# Altium project B202AA-PCIe.PrjPcb
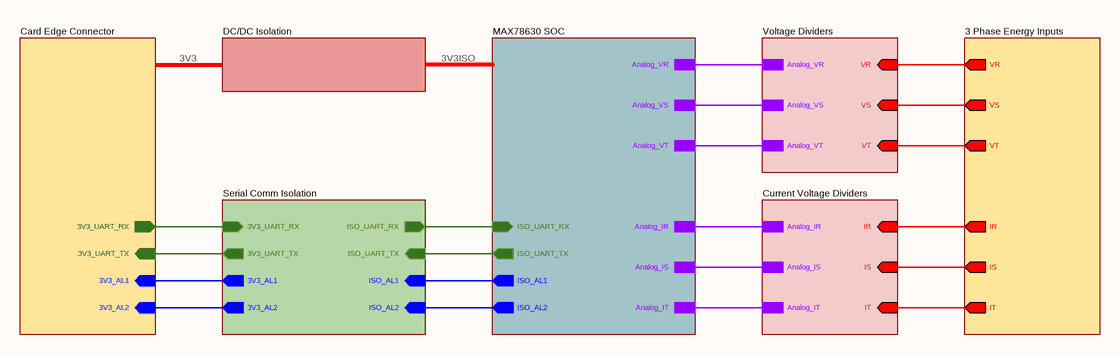
[diagram p0: Block Diagram.SchDoc]
Address1_: Buyuk Kayacik Mah. 4. OSB; Address2_: 103. Cad. No : 12; Address3_: Selcuklu / Konya; Address4_: Türkiye; Copyright_: Copyright 2022 STF Tarim (Commercial Secret); Customer_: -; Engineer_: Gunce Akkoyun; Git_Repo_Address_: www.github.com/akkoyun/B202AA-PCIe; Module_ID_: B202AA-PCIe; Organization_: -; Product_Desc_: PollyPhase Energy Analyzer; Product_ID_: B202AA-PCIe; Revision_: 00.00.01; Version_: R1
7 sheets, 64 parts. Net scope: hierarchical (ports join the sheet entries above them; power ports are global).
Board file: B202AA-PCIe.PcbDoc
Sheets:
  Block Diagram.SchDoc
    MAX78630 SOC = MAX78630 SOC.SchDoc
    Voltage Dividers = Phase Voltage Dividers.SchDoc
    Current Voltage Dividers = Current Voltage Dividers.SchDoc
    Serial Comm Isolation = Signal Isolation.SchDoc
    DC/DC Isolation = Power Isolation.SchDoc
    Card Edge Connector = Card Edge Connecgtor.SchDoc

## Sheet Block Diagram.SchDoc: B202AA Block Diagram
size 292 x 193 mm; SheetNumber: 1; SheetTotal: 8

### Sub-sheets
3 Phase Energy Inputs = Energy Inputs.SchDoc (file not in this document): VS (out), VR (out), IS (out), IT (out), VT (out), IR (out)
Card Edge Connector = Card Edge Connecgtor.SchDoc: 3V3_UART_RX (out), 3V3_UART_TX (in), 3V3_AL1 (in), 3V3_AL2 (in)
Current Voltage Dividers = Current Voltage Dividers.SchDoc: Analog_IS, Analog_IT, Analog_IR, IT (in), IS (in), IR (in)
DC/DC Isolation = Power Isolation.SchDoc: no entries
MAX78630 SOC = MAX78630 SOC.SchDoc: Analog_VR, Analog_VS, Analog_VT, Analog_IS, Analog_IT, Analog_IR, ISO_UART_RX (in), ISO_UART_TX (out), ISO_AL1 (out), ISO_AL2 (out)
Serial Comm Isolation = Signal Isolation.SchDoc: 3V3_UART_TX (out), 3V3_UART_RX (in), ISO_UART_RX (out), ISO_UART_TX (in), ISO_AL2 (in), 3V3_AL2 (out), 3V3_AL1 (out), ISO_AL1 (in)
Voltage Dividers = Phase Voltage Dividers.SchDoc: Analog_VR, Analog_VS, Analog_VT, VR (in), VT (in), VS (in)

### Nets
3V3_AL1: sheet Serial Comm Isolation/3V3_AL1, sheet Card Edge Connector/3V3_AL1
3V3_AL2: sheet Serial Comm Isolation/3V3_AL2, sheet Card Edge Connector/3V3_AL2
3V3_UART_RX: sheet Serial Comm Isolation/3V3_UART_RX, sheet Card Edge Connector/3V3_UART_RX
3V3_UART_TX: sheet Serial Comm Isolation/3V3_UART_TX, sheet Card Edge Connector/3V3_UART_TX
Analog_IR: sheet MAX78630 SOC/Analog_IR, sheet Current Voltage Dividers/Analog_IR
Analog_IS: sheet MAX78630 SOC/Analog_IS, sheet Current Voltage Dividers/Analog_IS
Analog_IT: sheet MAX78630 SOC/Analog_IT, sheet Current Voltage Dividers/Analog_IT
Analog_VR: sheet MAX78630 SOC/Analog_VR, sheet Voltage Dividers/Analog_VR
Analog_VS: sheet MAX78630 SOC/Analog_VS, sheet Voltage Dividers/Analog_VS
Analog_VT: sheet MAX78630 SOC/Analog_VT, sheet Voltage Dividers/Analog_VT
IR: sheet Current Voltage Dividers/IR, sheet 3 Phase Energy Inputs/IR
IS: sheet Current Voltage Dividers/IS, sheet 3 Phase Energy Inputs/IS
ISO_AL1: sheet MAX78630 SOC/ISO_AL1, sheet Serial Comm Isolation/ISO_AL1
ISO_AL2: sheet MAX78630 SOC/ISO_AL2, sheet Serial Comm Isolation/ISO_AL2
ISO_UART_RX: sheet MAX78630 SOC/ISO_UART_RX, sheet Serial Comm Isolation/ISO_UART_RX
ISO_UART_TX: sheet MAX78630 SOC/ISO_UART_TX, sheet Serial Comm Isolation/ISO_UART_TX
IT: sheet Current Voltage Dividers/IT, sheet 3 Phase Energy Inputs/IT
VR: sheet Voltage Dividers/VR, sheet 3 Phase Energy Inputs/VR
VS: sheet Voltage Dividers/VS, sheet 3 Phase Energy Inputs/VS
VT: sheet Voltage Dividers/VT, sheet 3 Phase Energy Inputs/VT

### Notes on the sheet
- 3V3
- 3V3ISO
- © 2021 All rights reserved.
  This document may not, in whole or in part, be copied, photocopied, reproduced, translated or converted to any electronic or machine readable from without prior written permission of Mehmet Günce Akkoyun.
  Engineer contact : akkoyun@me.com
- Property of
- Engineer :
- Date :
- Size :
- A4
- Time :
- Project :
- Page :
- /
- Customer :
- Product ID :
- Module ID :
- Version :
- File :
- Revision :

## Sheet MAX78630 SOC.SchDoc: MAX78630 SOC Core
size 393 x 292 mm; SheetNumber: 8; SheetTotal: 8
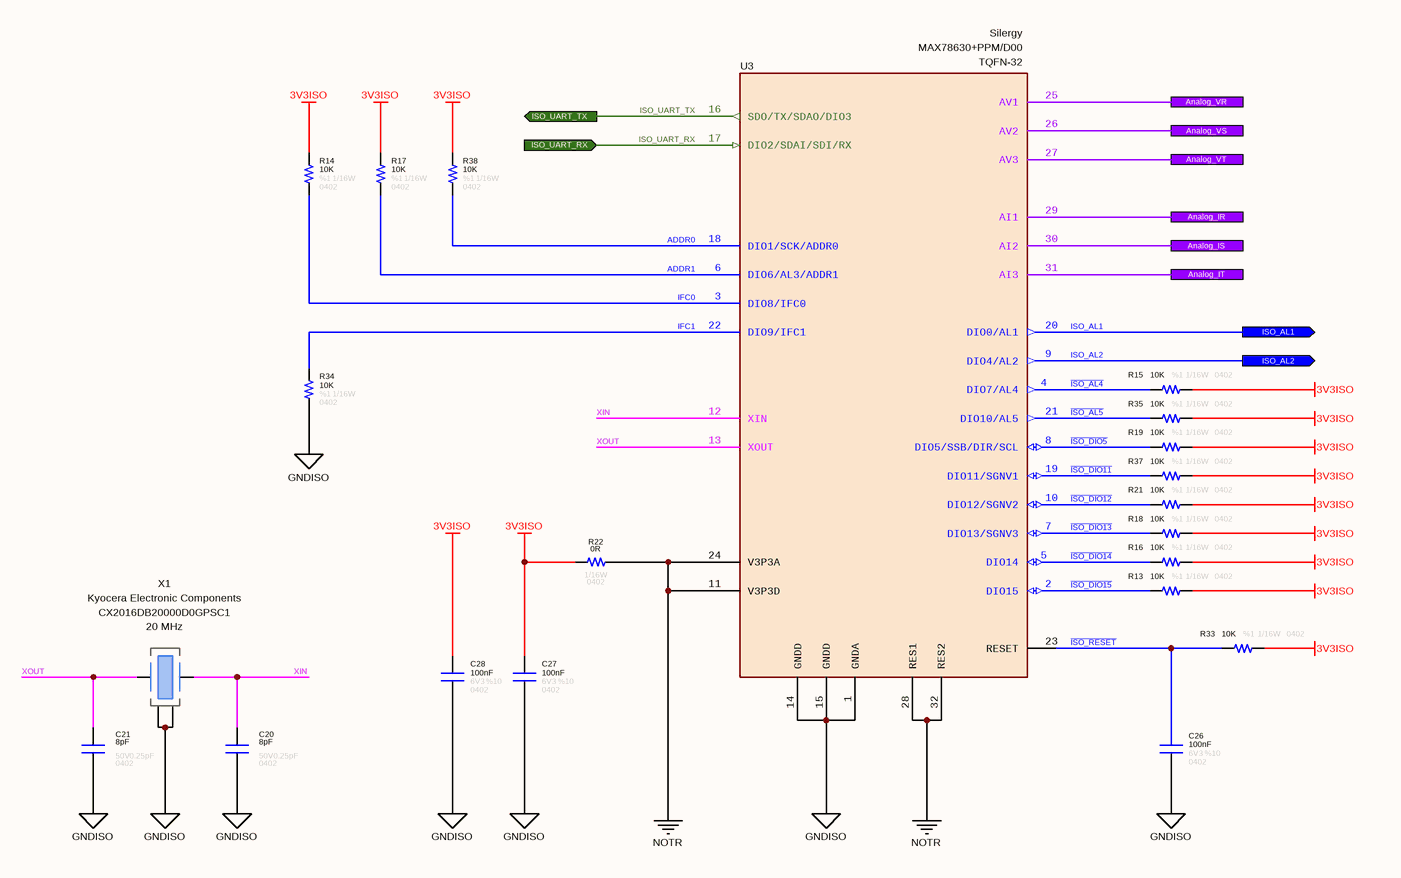
[diagram p1: MAX78630 SOC.SchDoc]

### Parts
C20  value 8pF  Tolerance: 0.25pF  Case: 0402  Voltage: 50V  [CAPACITOR_0402]  (hidden comment: Capacitor - 8pF [0402] (Ceramic))
C21  value 8pF  Tolerance: 0.25pF  Case: 0402  Voltage: 50V  [CAPACITOR_0402]  (hidden comment: Capacitor - 8pF [0402] (Ceramic))
C26  value 100nF  Tolerance: %10  Voltage: 6V3  Case: 0402  [CAPACITOR_0402]  (hidden comment: Capacitor - 100nF [0402] (Ceramic))
C27  value 100nF  Tolerance: %10  Voltage: 6V3  Case: 0402  [CAPACITOR_0402]  (hidden comment: Capacitor - 100nF [0402] (Ceramic))
C28  value 100nF  Tolerance: %10  Voltage: 6V3  Case: 0402  [CAPACITOR_0402]  (hidden comment: Capacitor - 100nF [0402] (Ceramic))
R13  value 10K  Tolerance: %1  Case: 0402  Power: 1/16W  [RESISTOR_0402]  (hidden comment: 10K - 0402 - %1 - 1/16W)
R14  value 10K  Tolerance: %1  Case: 0402  Power: 1/16W  [RESISTOR_0402]  (hidden comment: 10K - 0402 - %1 - 1/16W)
R15  value 10K  Tolerance: %1  Case: 0402  Power: 1/16W  [RESISTOR_0402]  (hidden comment: 10K - 0402 - %1 - 1/16W)
R16  value 10K  Tolerance: %1  Case: 0402  Power: 1/16W  [RESISTOR_0402]  (hidden comment: 10K - 0402 - %1 - 1/16W)
R17  value 10K  Tolerance: %1  Case: 0402  Power: 1/16W  [RESISTOR_0402]  (hidden comment: 10K - 0402 - %1 - 1/16W)
R18  value 10K  Tolerance: %1  Case: 0402  Power: 1/16W  [RESISTOR_0402]  (hidden comment: 10K - 0402 - %1 - 1/16W)
R19  value 10K  Tolerance: %1  Case: 0402  Power: 1/16W  [RESISTOR_0402]  (hidden comment: 10K - 0402 - %1 - 1/16W)
R21  value 10K  Tolerance: %1  Case: 0402  Power: 1/16W  [RESISTOR_0402]  (hidden comment: 10K - 0402 - %1 - 1/16W)
R22  value 0R  Case: 0402  Power: 1/16W  [RESISTOR_0402]  (hidden comment: 0R - 0402 - %1 - 1/16W)
R33  value 10K  Tolerance: %1  Case: 0402  Power: 1/16W  [RESISTOR_0402]  (hidden comment: 10K - 0402 - %1 - 1/16W)
R34  value 10K  Tolerance: %1  Case: 0402  Power: 1/16W  [RESISTOR_0402]  (hidden comment: 10K - 0402 - %1 - 1/16W)
R35  value 10K  Tolerance: %1  Case: 0402  Power: 1/16W  [RESISTOR_0402]  (hidden comment: 10K - 0402 - %1 - 1/16W)
R37  value 10K  Tolerance: %1  Case: 0402  Power: 1/16W  [RESISTOR_0402]  (hidden comment: 10K - 0402 - %1 - 1/16W)
R38  value 10K  Tolerance: %1  Case: 0402  Power: 1/16W  [RESISTOR_0402]  (hidden comment: 10K - 0402 - %1 - 1/16W)
U3  Manufacturer Name: Silergy  Case: TQFN-32  [TQFN-32 - Maxim]  (hidden comment: MAX78630+PPM/D00)
X1  Manufacturer Name: Kyocera Electronic Components  Frequency: 20 MHz  [CRYSTAL - 20MHz]  (hidden comment: CX2016DB20000D0GPSC1)

### Ports
Analog_IR, Analog_IS, Analog_IT, Analog_VR, Analog_VS, Analog_VT, ISO_AL1 (out), ISO_AL2 (out), ISO_UART_RX (in), ISO_UART_TX (out)

### Nets
3V3ISO: C27.2 C28.2 R13.1 R14.2 R15.1 R16.1 R17.2 R18.1 R19.1 R21.1 R22.2 R33.1 R35.1 R37.1 R38.2
GNDISO: C20.1 C21.1 C26.1 C27.1 C28.1 R34.1 U3.1(GNDA) U3.14(GNDD) U3.15(GNDD) X1.2(GND) X1.4(GND)
NOTR: R22.1 U3.11(V3P3D) U3.24(V3P3A) U3.28(RES1) U3.32(RES2)
ADDR0: R38.1 U3.18(DIO1/SCK/ADDR0)
ADDR1: R17.1 U3.6(DIO6/AL3/ADDR1)
Analog_IR: U3.29(AI1) ; port Analog_IR
Analog_IS: U3.30(AI2) ; port Analog_IS
Analog_IT: U3.31(AI3) ; port Analog_IT
Analog_VR: U3.25(AV1) ; port Analog_VR
Analog_VS: U3.26(AV2) ; port Analog_VS
Analog_VT: U3.27(AV3) ; port Analog_VT
~{ISO_AL4}: R15.2 U3.4(DIO7/AL4)
~{ISO_AL5}: R35.2 U3.21(DIO10/AL5)
~{ISO_DIO11}: R37.2 U3.19(DIO11/SGNV1)
~{ISO_DIO12}: R21.2 U3.10(DIO12/SGNV2)
~{ISO_DIO13}: R18.2 U3.7(DIO13/SGNV3)
~{ISO_DIO14}: R16.2 U3.5(DIO14)
~{ISO_DIO15}: R13.2 U3.2(DIO15)
~{ISO_DIO5}: R19.2 U3.8(DIO5/SSB/DIR/SCL)
~{ISO_RESET}: C26.2 R33.2 U3.23(RESET)
IFC0: R14.1 U3.3(DIO8/IFC0)
IFC1: R34.2 U3.22(DIO9/IFC1)
ISO_AL1: U3.20(DIO0/AL1) ; port ISO_AL1
ISO_AL2: U3.9(DIO4/AL2) ; port ISO_AL2
ISO_UART_RX: U3.17(DIO2/SDAI/SDI/RX) ; port ISO_UART_RX
ISO_UART_TX: U3.16(SDO/TX/SDAO/DIO3) ; port ISO_UART_TX
XIN: C20.2 U3.12(XIN) X1.1(IN/OUT)
XOUT: C21.2 U3.13(XOUT) X1.3(OUT/IN)

### Notes on the sheet
- © 2021 All rights reserved.
  This document may not, in whole or in part, be copied, photocopied, reproduced, translated or converted to any electronic or machine readable from without prior written permission of Mehmet Günce Akkoyun.
  Engineer contact : akkoyun@me.com
- Property of
- Engineer :
- Date :
- Size :
- A4
- Time :
- Project :
- Page :
- /
- Customer :
- Product ID :
- Module ID :
- Version :
- File :
- Revision :

### Library data of the parts
C20 C21 = Capacitor - 8pF [0402-50V]: Manufacturer Name: KYOCERA AVX; Manufacturer Part Number: 04025A8R0CAT2A
C26-C28 = Capacitor - 100nF [0402-6V3]: Capacitor - 100nF [0402-6V3] (Ceramic); Manufacturer Name: AVX; Manufacturer Part Number: 04026D104KAT4A; ComponentLink1Description: Mouser; ComponentLink1URL: https://www.mouser.com.tr/ProductDetail/AVX/04026D104KAT4A?qs=sGAEpiMZZMs0AnBnWHyRQPg4iYkCw7IMED%2F4kpqgf7w%3D; ComponentLink2Description: DataSheet; ComponentLink2URL: https://www.mouser.com.tr/datasheet/2/40/cx5r-776519.pdf
R13-R19 R21 R33-R35 R37 R38 = Resistor - 10K [0402]: Thick Film Resistors - SMD 1/16 W 10 KOhm 1%; Manufacturer Name: Vishay; Manufacturer Part Number: CRCW040210K0FKED; ComponentLink1Description: DataSheet; ComponentLink1URL: https://www.mouser.com.tr/datasheet/2/427/dcrcwe3-1762152.pdf; ComponentLink2Description: Mouser; ComponentLink2URL: https://www.mouser.com.tr/ProductDetail/Vishay-Dale/CRCW040210K0FKED?qs=sGAEpiMZZMu61qfTUdNhG2DpbjADlD3GcalbOv9utCY%3D
R22 = Resistor - 0R [0402]: Thick Film Resistors - SMD 1/16 W 0 Ohm; Manufacturer Name: Vishay; Manufacturer Part Number: CRCW04020000Z0ED; ComponentLink1Description: DataSheet; ComponentLink1URL: https://www.mouser.com.tr/datasheet/2/427/dcrcwe3-1762152.pdf; ComponentLink2Description: Mouser; ComponentLink2URL: https://www.mouser.com.tr/ProductDetail/Vishay-Dale/CRCW04020000Z0ED?qs=sGAEpiMZZMu61qfTUdNhG2DpbjADlD3GG34cJb50zyg%3D
U3 = IC - MAX78630: Energy Measurement Processor 32-Pin TQFN EP Tube; RoHS: Yes; Manufacturer Part Number: MAX78630+PPM/D00
X1 = Crystal - 20MHz: Crystals AEC-Q200 20000kHz 8pF 2x1.6mm; Case: SMD; Manufacturer Part Number: CX2016DB20000D0GPSC1

## Sheet Phase Voltage Dividers.SchDoc: 3 Phase Voltage Dividers
size 292 x 193 mm; SheetNumber: 10; SheetTotal: 12
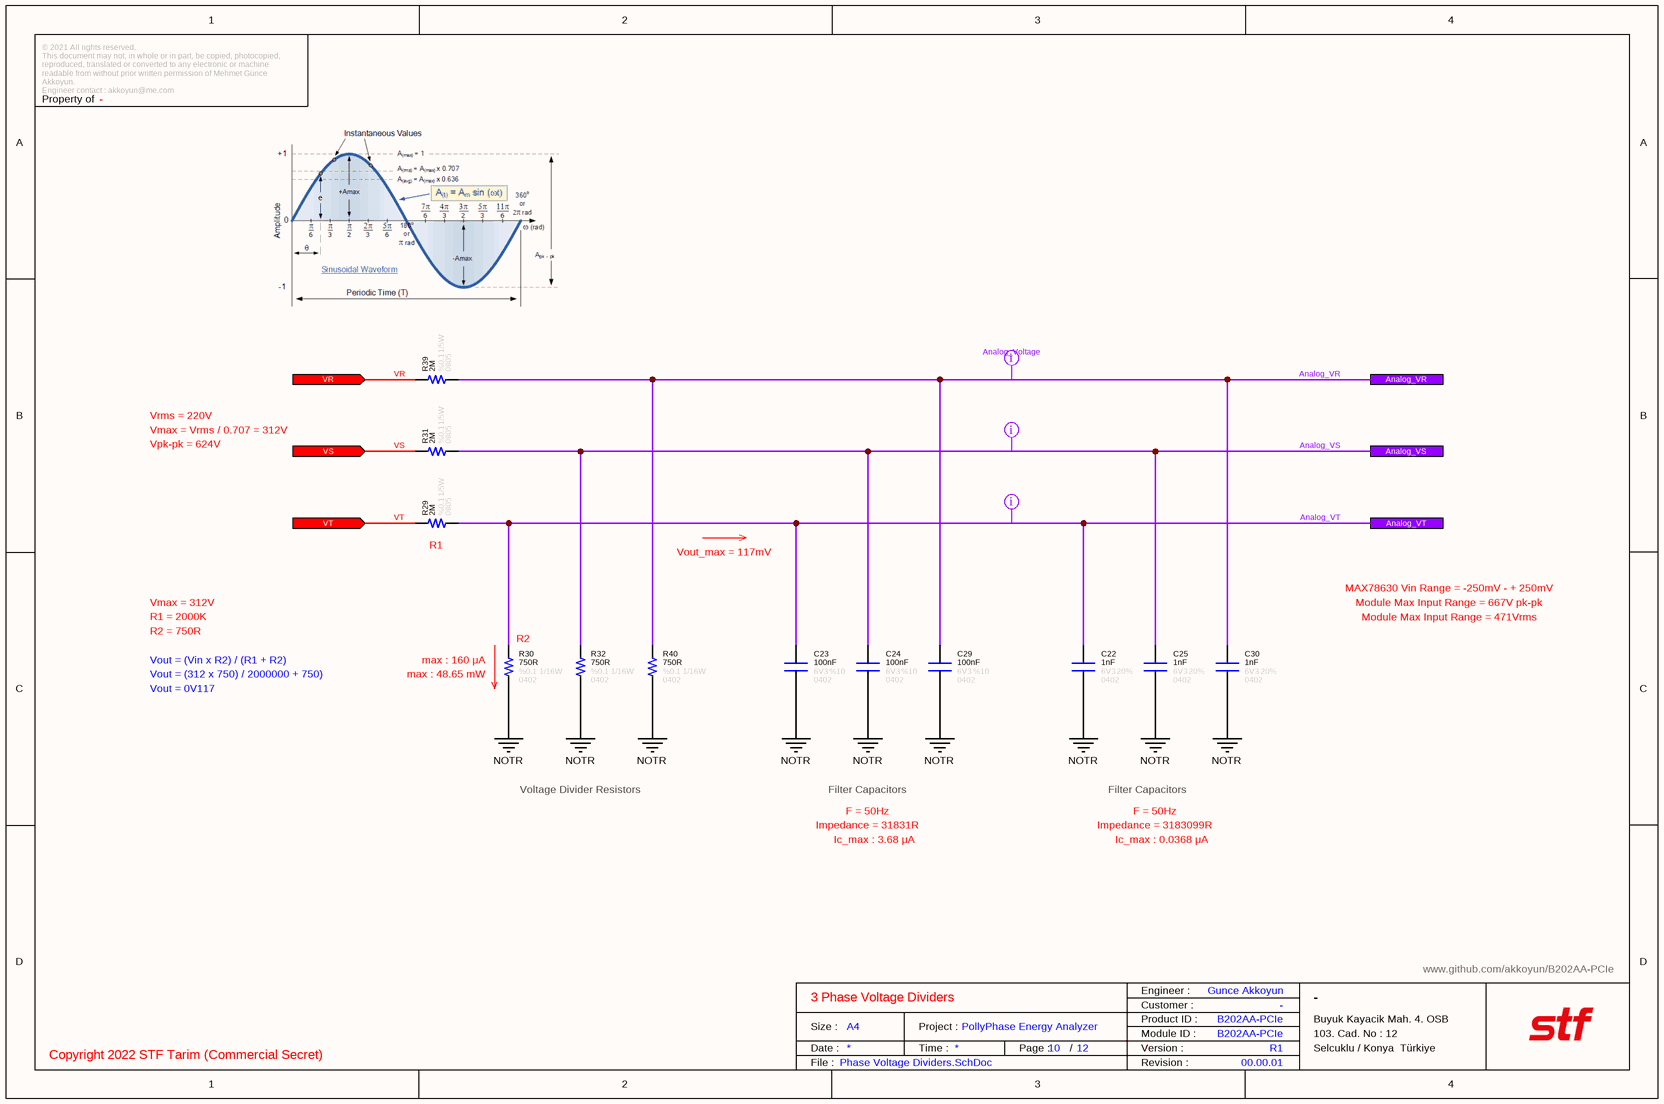
[diagram p2: Phase Voltage Dividers.SchDoc]

### Parts
C22  value 1nF  Tolerance: 20%  Case: 0402  Voltage: 6V3  [CAPACITOR_0402]  (hidden comment: Capacitor - 1nF [0402] (Ceramic))
C23  value 100nF  Tolerance: %10  Voltage: 6V3  Case: 0402  [CAPACITOR_0402]  (hidden comment: Capacitor - 100nF [0402] (Ceramic))
C24  value 100nF  Tolerance: %10  Voltage: 6V3  Case: 0402  [CAPACITOR_0402]  (hidden comment: Capacitor - 100nF [0402] (Ceramic))
C25  value 1nF  Tolerance: 20%  Case: 0402  Voltage: 6V3  [CAPACITOR_0402]  (hidden comment: Capacitor - 1nF [0402] (Ceramic))
C29  value 100nF  Tolerance: %10  Voltage: 6V3  Case: 0402  [CAPACITOR_0402]  (hidden comment: Capacitor - 100nF [0402] (Ceramic))
C30  value 1nF  Tolerance: 20%  Case: 0402  Voltage: 6V3  [CAPACITOR_0402]  (hidden comment: Capacitor - 1nF [0402] (Ceramic))
R29  value 2M  Case: 0805  Tolerance: %0.1  Power: 1/5W  [RESISTOR_0805]  (hidden comment: 2M - 0805 - %0.1 - 1/5W)
R30  value 750R  Case: 0402  Tolerance: %0.1  Power: 1/16W  [RESISTOR_0402]  (hidden comment: 750R - 0402 - %0.1 - 1/16W)
R31  value 2M  Case: 0805  Tolerance: %0.1  Power: 1/5W  [RESISTOR_0805]  (hidden comment: 2M - 0805 - %0.1 - 1/5W)
R32  value 750R  Case: 0402  Tolerance: %0.1  Power: 1/16W  [RESISTOR_0402]  (hidden comment: 750R - 0402 - %0.1 - 1/16W)
R39  value 2M  Case: 0805  Tolerance: %0.1  Power: 1/5W  [RESISTOR_0805]  (hidden comment: 2M - 0805 - %0.1 - 1/5W)
R40  value 750R  Case: 0402  Tolerance: %0.1  Power: 1/16W  [RESISTOR_0402]  (hidden comment: 750R - 0402 - %0.1 - 1/16W)

### Ports
Analog_VR, Analog_VS, Analog_VT, VR (in), VS (in), VT (in)

### Nets
NOTR: C22.1 C23.1 C24.1 C25.1 C29.1 C30.1 R30.1 R32.1 R40.1
Analog_VR: C29.2 C30.2 R39.1 R40.2 ; port Analog_VR
Analog_VS: C24.2 C25.2 R31.1 R32.2 ; port Analog_VS
Analog_VT: C22.2 C23.2 R29.1 R30.2 ; port Analog_VT
VR: R39.2 ; port VR
VS: R31.2 ; port VS
VT: R29.2 ; port VT

### Layout directives
net class Analog_Voltage: Analog_VR, Analog_VS, Analog_VT

### Notes on the sheet
- Vrms = 220V
- Vmax = Vrms / 0.707 = 312V
- Vpk-pk = 624V
- (near R29) R1
- Vout_max = 117mV
- Vmax = 312V
- R1 = 2000K
- MAX78630 Vin Range = -250mV - + 250mV
- Module Max Input Range = 667V pk-pk
- Module Max Input Range = 471Vrms
- Vout = (Vin x R2) / (R1 + R2)
- R2 = 750R
- Vout = (312 x 750) / 2000000 + 750)
- Vout = 0V117
- (near R30) max : 160 μA
- (near R30) max : 48.65 mW
- (near R30) R2
- Voltage Divider Resistors
- Filter Capacitors
- F = 50Hz
- Impedance = 31831R
- Ic_max : 3.68 μA
- Impedance = 3183099R
- Ic_max : 0.0368 μA
- © 2021 All rights reserved.
  This document may not, in whole or in part, be copied, photocopied, reproduced, translated or converted to any electronic or machine readable from without prior written permission of Mehmet Günce Akkoyun.
  Engineer contact : akkoyun@me.com
- Property of
- Engineer :
- Date :
- Size :
- A4
- Time :
- Project :
- Page :
- /
- Customer :
- Product ID :
- Module ID :
- Version :
- File :
- Revision :

### Library data of the parts
C22 C25 C30 = Capacitor - 1nF [0402-6V3]: Manufacturer Name: AVX; Manufacturer Part Number: 04026C102MAT2A; ComponentLink1Description: DataSheet; ComponentLink1URL: https://www.mouser.com.tr/datasheet/2/40/X7RDielectric-777024.pdf
C23 C24 C29 = Capacitor - 100nF [0402-6V3]: as C26 on sheet MAX78630 SOC; ComponentLink1Description: Mouser; ComponentLink1URL: https://www.mouser.com.tr/ProductDetail/AVX/04026D104KAT4A?qs=sGAEpiMZZMs0AnBnWHyRQPg4iYkCw7IMED%2F4kpqgf7w%3D; ComponentLink2Description: DataSheet; ComponentLink2URL: https://www.mouser.com.tr/datasheet/2/40/cx5r-776519.pdf
R29 R31 R39 = Resistor - 2M [0805] %0.1: Thick Film Resistors - SMD 1/5 W 2 MOhm 0.1%; Manufacturer Name: Vishay; Manufacturer Part Number: MCU0805MD2004BP500; ComponentLink1Description: DataSheet; ComponentLink1URL: https://www.mouser.com.tr/datasheet/2/427/dcrcwe3-1762152.pdf; ComponentLink2Description: Mouser; ComponentLink2URL: https://www.mouser.com.tr/ProductDetail/Vishay-Dale/CRCW0402330RFKED?qs=sGAEpiMZZMu61qfTUdNhG2DpbjADlD3GGS6SwBlLi5Q%3D
R30 R32 R40 = Resistor - 750R [0402] %0.1: Thick Film Resistors - SMD 1/16 W 750 Ohm 0.1%; Manufacturer Name: Vishay; Manufacturer Part Number: MCS04020D7500BE000; ComponentLink1Description: DataSheet; ComponentLink1URL: https://www.mouser.com.tr/datasheet/2/427/dcrcwe3-1762152.pdf; ComponentLink2Description: Mouser; ComponentLink2URL: https://www.mouser.com.tr/ProductDetail/Vishay-Dale/CRCW0402330RFKED?qs=sGAEpiMZZMu61qfTUdNhG2DpbjADlD3GGS6SwBlLi5Q%3D

## Sheet Current Voltage Dividers.SchDoc: 3 Phase Current Voltage Dividers
size 292 x 193 mm; SheetNumber: 11; SheetTotal: 12
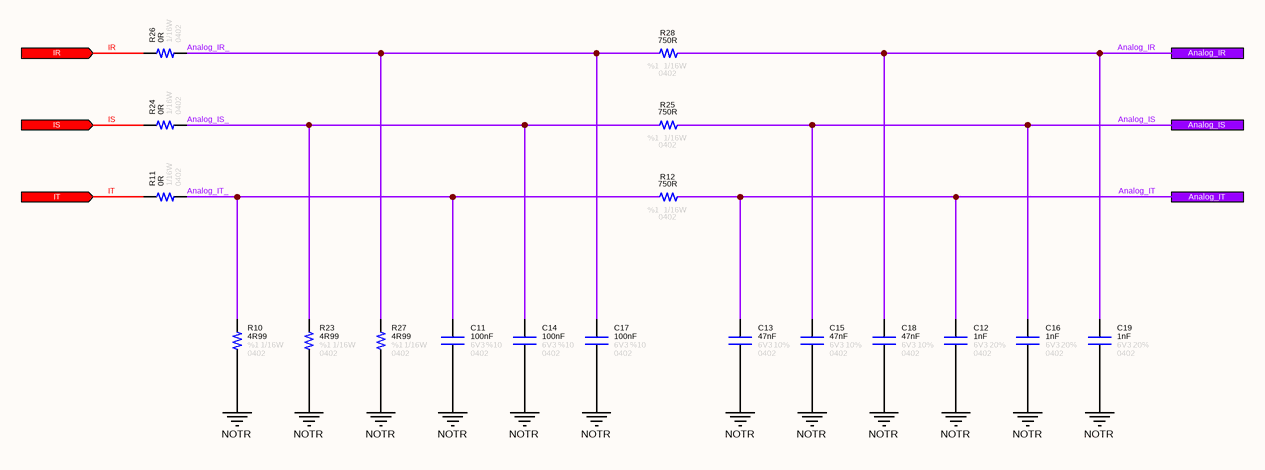
[diagram p3: Current Voltage Dividers.SchDoc]

### Parts
C11  value 100nF  Tolerance: %10  Voltage: 6V3  Case: 0402  [CAPACITOR_0402]  (hidden comment: Capacitor - 100nF [0402] (Ceramic))
C12  value 1nF  Tolerance: 20%  Case: 0402  Voltage: 6V3  [CAPACITOR_0402]  (hidden comment: Capacitor - 1nF [0402] (Ceramic))
C13  value 47nF  Tolerance: 10%  Case: 0402  Voltage: 6V3  [CAPACITOR_0402]  (hidden comment: Capacitor - 47nF [0402] (Ceramic))
C14  value 100nF  Tolerance: %10  Voltage: 6V3  Case: 0402  [CAPACITOR_0402]  (hidden comment: Capacitor - 100nF [0402] (Ceramic))
C15  value 47nF  Tolerance: 10%  Case: 0402  Voltage: 6V3  [CAPACITOR_0402]  (hidden comment: Capacitor - 47nF [0402] (Ceramic))
C16  value 1nF  Tolerance: 20%  Case: 0402  Voltage: 6V3  [CAPACITOR_0402]  (hidden comment: Capacitor - 1nF [0402] (Ceramic))
C17  value 100nF  Tolerance: %10  Voltage: 6V3  Case: 0402  [CAPACITOR_0402]  (hidden comment: Capacitor - 100nF [0402] (Ceramic))
C18  value 47nF  Tolerance: 10%  Case: 0402  Voltage: 6V3  [CAPACITOR_0402]  (hidden comment: Capacitor - 47nF [0402] (Ceramic))
C19  value 1nF  Tolerance: 20%  Case: 0402  Voltage: 6V3  [CAPACITOR_0402]  (hidden comment: Capacitor - 1nF [0402] (Ceramic))
R10  value 4R99  Case: 0402  Tolerance: %1  Power: 1/16W  [RESISTOR_0402]  (hidden comment: 4R99 - 0402 - %1 - 1/16W)
R11  value 0R  Case: 0402  Power: 1/16W  [RESISTOR_0402]  (hidden comment: 0R - 0402 - %1 - 1/16W)
R12  value 750R  Case: 0402  Tolerance: %1  Power: 1/16W  [RESISTOR_0402]  (hidden comment: 750R - 0402 - %1 - 1/16W)
R23  value 4R99  Case: 0402  Tolerance: %1  Power: 1/16W  [RESISTOR_0402]  (hidden comment: 4R99 - 0402 - %1 - 1/16W)
R24  value 0R  Case: 0402  Power: 1/16W  [RESISTOR_0402]  (hidden comment: 0R - 0402 - %1 - 1/16W)
R25  value 750R  Case: 0402  Tolerance: %1  Power: 1/16W  [RESISTOR_0402]  (hidden comment: 750R - 0402 - %1 - 1/16W)
R26  value 0R  Case: 0402  Power: 1/16W  [RESISTOR_0402]  (hidden comment: 0R - 0402 - %1 - 1/16W)
R27  value 4R99  Case: 0402  Tolerance: %1  Power: 1/16W  [RESISTOR_0402]  (hidden comment: 4R99 - 0402 - %1 - 1/16W)
R28  value 750R  Case: 0402  Tolerance: %1  Power: 1/16W  [RESISTOR_0402]  (hidden comment: 750R - 0402 - %1 - 1/16W)

### Ports
Analog_IR, Analog_IS, Analog_IT, IR (in), IS (in), IT (in)

### Nets
NOTR: C11.1 C12.1 C13.1 C14.1 C15.1 C16.1 C17.1 C18.1 C19.1 R10.1 R23.1 R27.1
Analog_IR: C18.2 C19.2 R28.1 ; port Analog_IR
Analog_IR_: C17.2 R26.1 R27.2 R28.2
Analog_IS: C15.2 C16.2 R25.1 ; port Analog_IS
Analog_IS_: C14.2 R23.2 R24.1 R25.2
Analog_IT: C12.2 C13.2 R12.1 ; port Analog_IT
Analog_IT_: C11.2 R10.2 R11.1 R12.2
IR: R26.2 ; port IR
IS: R24.2 ; port IS
IT: R11.2 ; port IT

### Notes on the sheet
- © 2021 All rights reserved.
  This document may not, in whole or in part, be copied, photocopied, reproduced, translated or converted to any electronic or machine readable from without prior written permission of Mehmet Günce Akkoyun.
  Engineer contact : akkoyun@me.com
- Property of
- Engineer :
- Date :
- Size :
- A4
- Time :
- Project :
- Page :
- /
- Customer :
- Product ID :
- Module ID :
- Version :
- File :
- Revision :

### Library data of the parts
C11 C14 C17 = Capacitor - 100nF [0402-6V3]: as C26 on sheet MAX78630 SOC; ComponentLink1Description: Mouser; ComponentLink1URL: https://www.mouser.com.tr/ProductDetail/AVX/04026D104KAT4A?qs=sGAEpiMZZMs0AnBnWHyRQPg4iYkCw7IMED%2F4kpqgf7w%3D; ComponentLink2Description: DataSheet; ComponentLink2URL: https://www.mouser.com.tr/datasheet/2/40/cx5r-776519.pdf
C12 C16 C19 = Capacitor - 1nF [0402-6V3]: as C22 on sheet Phase Voltage Dividers; ComponentLink1Description: DataSheet; ComponentLink1URL: https://www.mouser.com.tr/datasheet/2/40/X7RDielectric-777024.pdf
C13 C15 C18 = Capacitor - 47nF [0402-6V3]: Multilayer Ceramic Capacitors - SMD - 6.3V 47nF X7R 0402 10%; Manufacturer Name: AVX; Manufacturer Part Number: 04026C473KAT2A
R10 R23 R27 = Resistor - 4R99 [0402]: Thick Film Resistors - SMD 1/16 W 33 Ohm 1%; Manufacturer Name: Bourns; Manufacturer Part Number: CRT0402-FZ-4R99GLF; ComponentLink1Description: DataSheet; ComponentLink1URL: https://www.mouser.com.tr/datasheet/2/427/dcrcwe3-1762152.pdf; ComponentLink2Description: Mouser; ComponentLink2URL: https://www.mouser.com.tr/ProductDetail/Vishay-Dale/CRCW0402330RFKED?qs=sGAEpiMZZMu61qfTUdNhG2DpbjADlD3GGS6SwBlLi5Q%3D
R11 R24 R26 = Resistor - 0R [0402]: as R22 on sheet MAX78630 SOC; ComponentLink1Description: DataSheet; ComponentLink1URL: https://www.mouser.com.tr/datasheet/2/427/dcrcwe3-1762152.pdf; ComponentLink2Description: Mouser; ComponentLink2URL: https://www.mouser.com.tr/ProductDetail/Vishay-Dale/CRCW04020000Z0ED?qs=sGAEpiMZZMu61qfTUdNhG2DpbjADlD3GG34cJb50zyg%3D
R12 R25 R28 = Resistor - 750R [0402]: Thick Film Resistors - SMD 1/16 W 750 Ohm 1%; Manufacturer Name: Vishay; Manufacturer Part Number: CRCW0402750RFKED; ComponentLink1Description: DataSheet; ComponentLink1URL: https://www.mouser.com.tr/datasheet/2/427/dcrcwe3-1762152.pdf; ComponentLink2Description: Mouser; ComponentLink2URL: https://www.mouser.com.tr/ProductDetail/Vishay-Dale/CRCW0402330RFKED?qs=sGAEpiMZZMu61qfTUdNhG2DpbjADlD3GGS6SwBlLi5Q%3D

## Sheet Signal Isolation.SchDoc: UART & Signal Isolation
size 292 x 193 mm; SheetNumber: 1; SheetTotal: 8
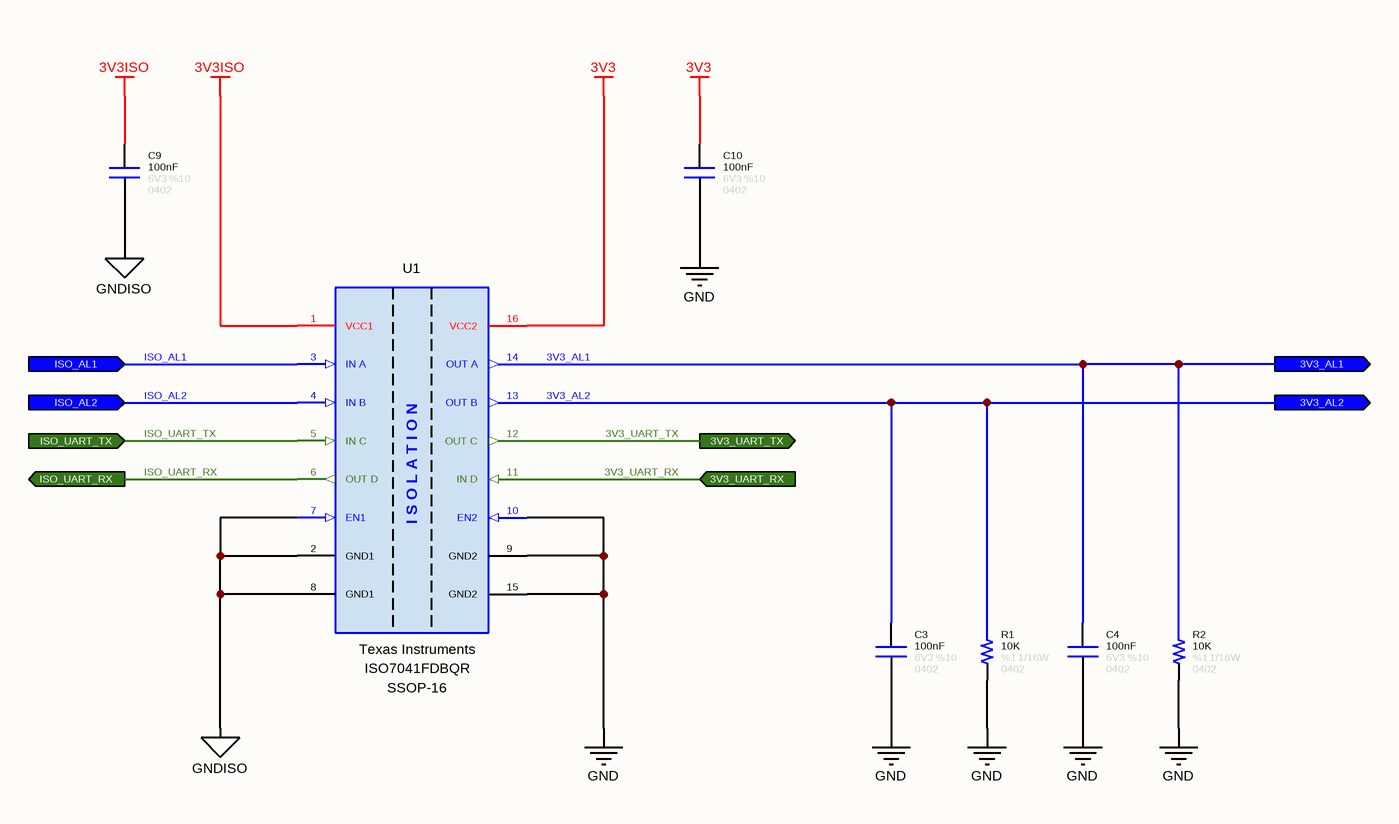
[diagram p4: Signal Isolation.SchDoc]

### Parts
C3  value 100nF  Tolerance: %10  Voltage: 6V3  Case: 0402  [CAPACITOR_0402]  (hidden comment: Capacitor - 100nF [0402] (Ceramic))
C4  value 100nF  Tolerance: %10  Voltage: 6V3  Case: 0402  [CAPACITOR_0402]  (hidden comment: Capacitor - 100nF [0402] (Ceramic))
C9  value 100nF  Tolerance: %10  Voltage: 6V3  Case: 0402  [CAPACITOR_0402]  (hidden comment: Capacitor - 100nF [0402] (Ceramic))
C10  value 100nF  Tolerance: %10  Voltage: 6V3  Case: 0402  [CAPACITOR_0402]  (hidden comment: Capacitor - 100nF [0402] (Ceramic))
R1  value 10K  Tolerance: %1  Case: 0402  Power: 1/16W  [RESISTOR_0402]  (hidden comment: 10K - 0402 - %1 - 1/16W)
R2  value 10K  Tolerance: %1  Case: 0402  Power: 1/16W  [RESISTOR_0402]  (hidden comment: 10K - 0402 - %1 - 1/16W)
U1  Manufacturer Name: Texas Instruments  Manufacturer Part Number: ISO7041FDBQR  [SSOP-16]  (hidden comment: ISO7041)

### Ports
3V3_AL1 (out), 3V3_AL2 (out), 3V3_UART_RX (in), 3V3_UART_TX (out), ISO_AL1 (in), ISO_AL2 (in), ISO_UART_RX (out), ISO_UART_TX (in)

### Nets
3V3: C10.2 U1.16(VCC2)
3V3ISO: C9.2 U1.1(VCC1)
GND: C3.1 C4.1 C10.1 R1.1 R2.1 U1.9(GND2) U1.10(EN2) U1.15(GND2)
GNDISO: C9.1 U1.2(GND1) U1.7(EN1) U1.8(GND1)
3V3_AL1: C4.2 R2.2 U1.14(OUT_A) ; port 3V3_AL1
3V3_AL2: C3.2 R1.2 U1.13(OUT_B) ; port 3V3_AL2
3V3_UART_RX: U1.11(IN_D) ; port 3V3_UART_RX
3V3_UART_TX: U1.12(OUT_C) ; port 3V3_UART_TX
ISO_AL1: U1.3(IN_A) ; port ISO_AL1
ISO_AL2: U1.4(IN_B) ; port ISO_AL2
ISO_UART_RX: U1.6(OUT_D) ; port ISO_UART_RX
ISO_UART_TX: U1.5(IN_C) ; port ISO_UART_TX

### Notes on the sheet
- © 2021 All rights reserved.
  This document may not, in whole or in part, be copied, photocopied, reproduced, translated or converted to any electronic or machine readable from without prior written permission of Mehmet Günce Akkoyun.
  Engineer contact : akkoyun@me.com
- Property of
- Engineer :
- Date :
- Size :
- A4
- Time :
- Project :
- Page :
- /
- Customer :
- Product ID :
- Module ID :
- Version :
- File :
- Revision :
- (in symbol IC - ISO7041) I S O L A T I O N

### Library data of the parts
C3 C4 C9 C10 = Capacitor - 100nF [0402-6V3]: as C26 on sheet MAX78630 SOC; ComponentLink1Description: Mouser; ComponentLink1URL: https://www.mouser.com.tr/ProductDetail/AVX/04026D104KAT4A?qs=sGAEpiMZZMs0AnBnWHyRQPg4iYkCw7IMED%2F4kpqgf7w%3D; ComponentLink2Description: DataSheet; ComponentLink2URL: https://www.mouser.com.tr/datasheet/2/40/cx5r-776519.pdf
R1 R2 = Resistor - 10K [0402]: as R13 on sheet MAX78630 SOC; ComponentLink1Description: DataSheet; ComponentLink1URL: https://www.mouser.com.tr/datasheet/2/427/dcrcwe3-1762152.pdf; ComponentLink2Description: Mouser; ComponentLink2URL: https://www.mouser.com.tr/ProductDetail/Vishay-Dale/CRCW040210K0FKED?qs=sGAEpiMZZMu61qfTUdNhG2DpbjADlD3GcalbOv9utCY%3D
U1 = IC - ISO7041: Digital Isolators Ultra-low power, ATEX/IECEx-certified, four-channel digital isolator 16-SSOP -55 to 125; Isolation Voltage: 3000 Vrms; Supply Voltage - Min: 2.25 V; Supply Voltage - Max: 3.6 V; Isolation Type: Capacitive Coupling; Operating Supply Current: 115.7 uA; Case: SSOP-16

## Sheet Power Isolation.SchDoc: Power Isolation
size 292 x 193 mm; SheetNumber: 3; SheetTotal: 8
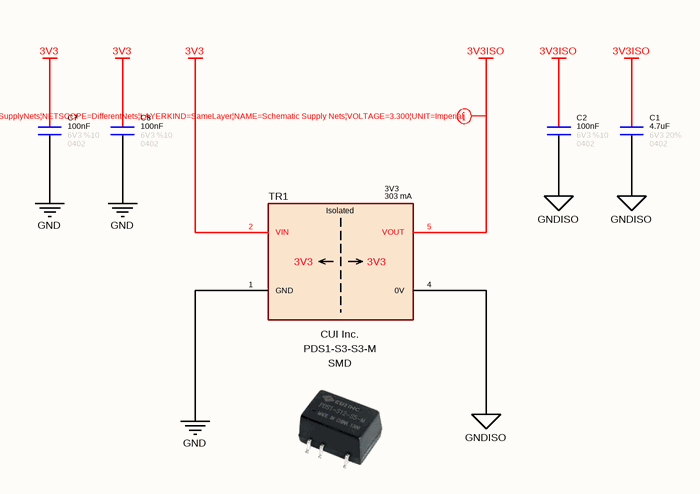
[diagram p5: Power Isolation.SchDoc]

### Parts
C1  value 4.7uF  Tolerance: 20%  Case: 0402  Voltage: 6V3  [CAPACITOR_0402]  (hidden comment: Capacitor - 4.7uF [0402] (Ceramic))
C2  value 100nF  Tolerance: %10  Voltage: 6V3  Case: 0402  [CAPACITOR_0402]  (hidden comment: Capacitor - 100nF [0402] (Ceramic))
C7  value 100nF  Tolerance: %10  Voltage: 6V3  Case: 0402  [CAPACITOR_0402]  (hidden comment: Capacitor - 100nF [0402] (Ceramic))
C8  value 100nF  Tolerance: %10  Voltage: 6V3  Case: 0402  [CAPACITOR_0402]  (hidden comment: Capacitor - 100nF [0402] (Ceramic))
TR1  Output Current: 303 mA  Output Voltage: 3V3  Manufacturer Name: CUI Inc.  Case: SMD  [PDS1-Sx-Sx-M]  (hidden comment: PDS1-S3-S3-M)

### Nets
3V3: C7.2 C8.2 TR1.2(VIN)
3V3ISO: C1.2 C2.2 TR1.5(VOUT)
GND: C7.1 C8.1 TR1.1(GND)
GNDISO: C1.1 C2.1 TR1.4(0V)

Not connected (* = marked no-connect by the designer): TR1 8(Terminator)

### Layout directives
rule Supply Nets [Voltage = 3.300]: 3V3ISO

### Notes on the sheet
- © 2021 All rights reserved.
  This document may not, in whole or in part, be copied, photocopied, reproduced, translated or converted to any electronic or machine readable from without prior written permission of Mehmet Günce Akkoyun.
  Engineer contact : akkoyun@me.com
- Property of
- Engineer :
- Date :
- Size :
- A4
- Time :
- Project :
- Page :
- /
- Customer :
- Product ID :
- Module ID :
- Version :
- File :
- Revision :
- (in symbol Transformator - PDS1-Sx-Sx-M) Isolated

### Library data of the parts
C1 = Capacitor - 4.7uF [0402-6V3]: Multilayer Ceramic Capacitors - SMD - 6V3 4.7uF X5R 0402 20%; Manufacturer Part Number: C0402C475M9PACTU; Manufacturer Name: KEMET
C2 C7 C8 = Capacitor - 100nF [0402-6V3]: as C26 on sheet MAX78630 SOC; ComponentLink1Description: Mouser; ComponentLink1URL: https://www.mouser.com.tr/ProductDetail/AVX/04026D104KAT4A?qs=sGAEpiMZZMs0AnBnWHyRQPg4iYkCw7IMED%2F4kpqgf7w%3D; ComponentLink2Description: DataSheet; ComponentLink2URL: https://www.mouser.com.tr/datasheet/2/40/cx5r-776519.pdf
TR1 = Transformator - PDS1-Sx-Sx-M: Module DC-DC 3.3VIN 1-OUT 3.3V 0.303A 1W 5-Pin SMD Module; Manufacturer Part Number: PDS1-S3-S3-M

## Sheet Card Edge Connecgtor.SchDoc: Card Edge Connector
size 292 x 193 mm; SheetNumber: 2; SheetTotal: 8
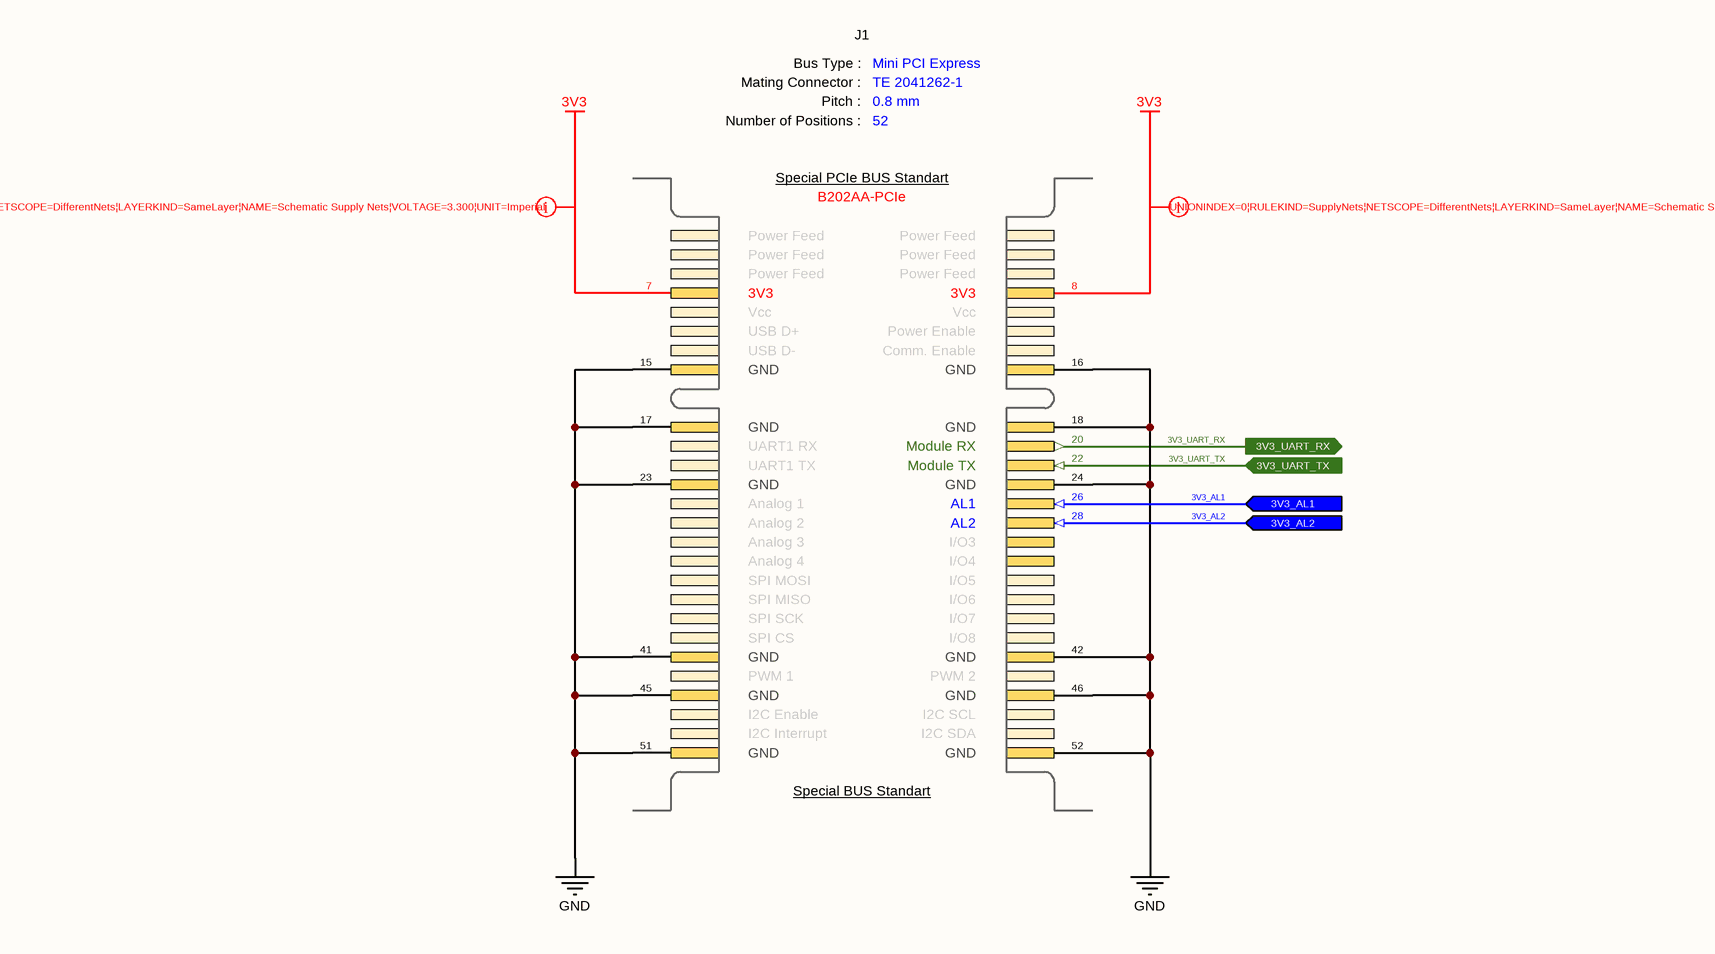
[diagram p6: Card Edge Connecgtor.SchDoc]

### Parts
J1  BUS Type: Mini PCI Express  Mating Connector: TE 2041262-1  Pitch: 0.8 mm  Number of Positions: 52  [PCB - Mini PCI Express]  (hidden comment: Connector - Mini PCI-E (Male B202AA-PCIe))  (no BOM)

### Ports
3V3_AL1 (in), 3V3_AL2 (in), 3V3_UART_RX (out), 3V3_UART_TX (in)

### Nets
3V3: J1.7(Pin-7) J1.8(Pin-8)
GND: J1.15(Pin-15) J1.16(Pin-16) J1.17(Pin-17) J1.18(Pin-18) J1.23(Pin-23) J1.24(Pin-24) J1.41(Pin-41) J1.42(Pin-42) J1.45(Pin-45) J1.46(Pin-46) J1.51(Pin-51) J1.52(Pin-52)
3V3_AL1: J1.26(Pin-26) ; port 3V3_AL1
3V3_AL2: J1.28(Pin-28) ; port 3V3_AL2
3V3_UART_RX: J1.20(Pin-20) ; port 3V3_UART_RX
3V3_UART_TX: J1.22(Pin-22) ; port 3V3_UART_TX

### Layout directives
rule Supply Nets [Voltage = 3.300]: 3V3

### Notes on the sheet
- © 2021 All rights reserved.
  This document may not, in whole or in part, be copied, photocopied, reproduced, translated or converted to any electronic or machine readable from without prior written permission of Mehmet Günce Akkoyun.
  Engineer contact : akkoyun@me.com
- Property of
- Engineer :
- Date :
- Size :
- A4
- Time :
- Project :
- Page :
- /
- Customer :
- Product ID :
- Module ID :
- Version :
- File :
- Revision :

### Library data of the parts
J1 = Connector - Mini PCI-E (Male B202AA-PCIe): Mini PCI-Express gold finger connector.; System: Connector

## Nets that join several sheets
3V3: Signal Isolation (C10.2 U1.16), Power Isolation (C7.2 C8.2 TR1.2), Card Edge Connecgtor (J1.7 J1.8)
3V3ISO: MAX78630 SOC (15 pins), Signal Isolation (C9.2 U1.1), Power Isolation (C1.2 C2.2 TR1.5)
GND: Signal Isolation (8 pins), Power Isolation (C7.1 C8.1 TR1.1), Card Edge Connecgtor (12 pins)
GNDISO: MAX78630 SOC (11 pins), Signal Isolation (C9.1 U1.2 U1.7 U1.8), Power Isolation (C1.1 C2.1 TR1.4)
NOTR: MAX78630 SOC (5 pins), Phase Voltage Dividers (9 pins), Current Voltage Dividers (12 pins)
3V3_AL1: Signal Isolation (C4.2 R2.2 U1.14), Card Edge Connecgtor (J1.26)
3V3_AL2: Signal Isolation (C3.2 R1.2 U1.13), Card Edge Connecgtor (J1.28)
3V3_UART_RX: Signal Isolation (U1.11), Card Edge Connecgtor (J1.20)
3V3_UART_TX: Signal Isolation (U1.12), Card Edge Connecgtor (J1.22)
Analog_IR: MAX78630 SOC (U3.29), Current Voltage Dividers (C18.2 C19.2 R28.1)
Analog_IS: MAX78630 SOC (U3.30), Current Voltage Dividers (C15.2 C16.2 R25.1)
Analog_IT: MAX78630 SOC (U3.31), Current Voltage Dividers (C12.2 C13.2 R12.1)
Analog_VR: MAX78630 SOC (U3.25), Phase Voltage Dividers (C29.2 C30.2 R39.1 R40.2)
Analog_VS: MAX78630 SOC (U3.26), Phase Voltage Dividers (C24.2 C25.2 R31.1 R32.2)
Analog_VT: MAX78630 SOC (U3.27), Phase Voltage Dividers (C22.2 C23.2 R29.1 R30.2)
ISO_AL1: MAX78630 SOC (U3.20), Signal Isolation (U1.3)
ISO_AL2: MAX78630 SOC (U3.9), Signal Isolation (U1.4)
ISO_UART_RX: MAX78630 SOC (U3.17), Signal Isolation (U1.6)
ISO_UART_TX: MAX78630 SOC (U3.16), Signal Isolation (U1.5)

## Assembly variants
PCB Mount: not fitted J2